# EAGLE design Adafruit I2S Audio UDA1334 Bonnet (EAGLE 9.2.0)
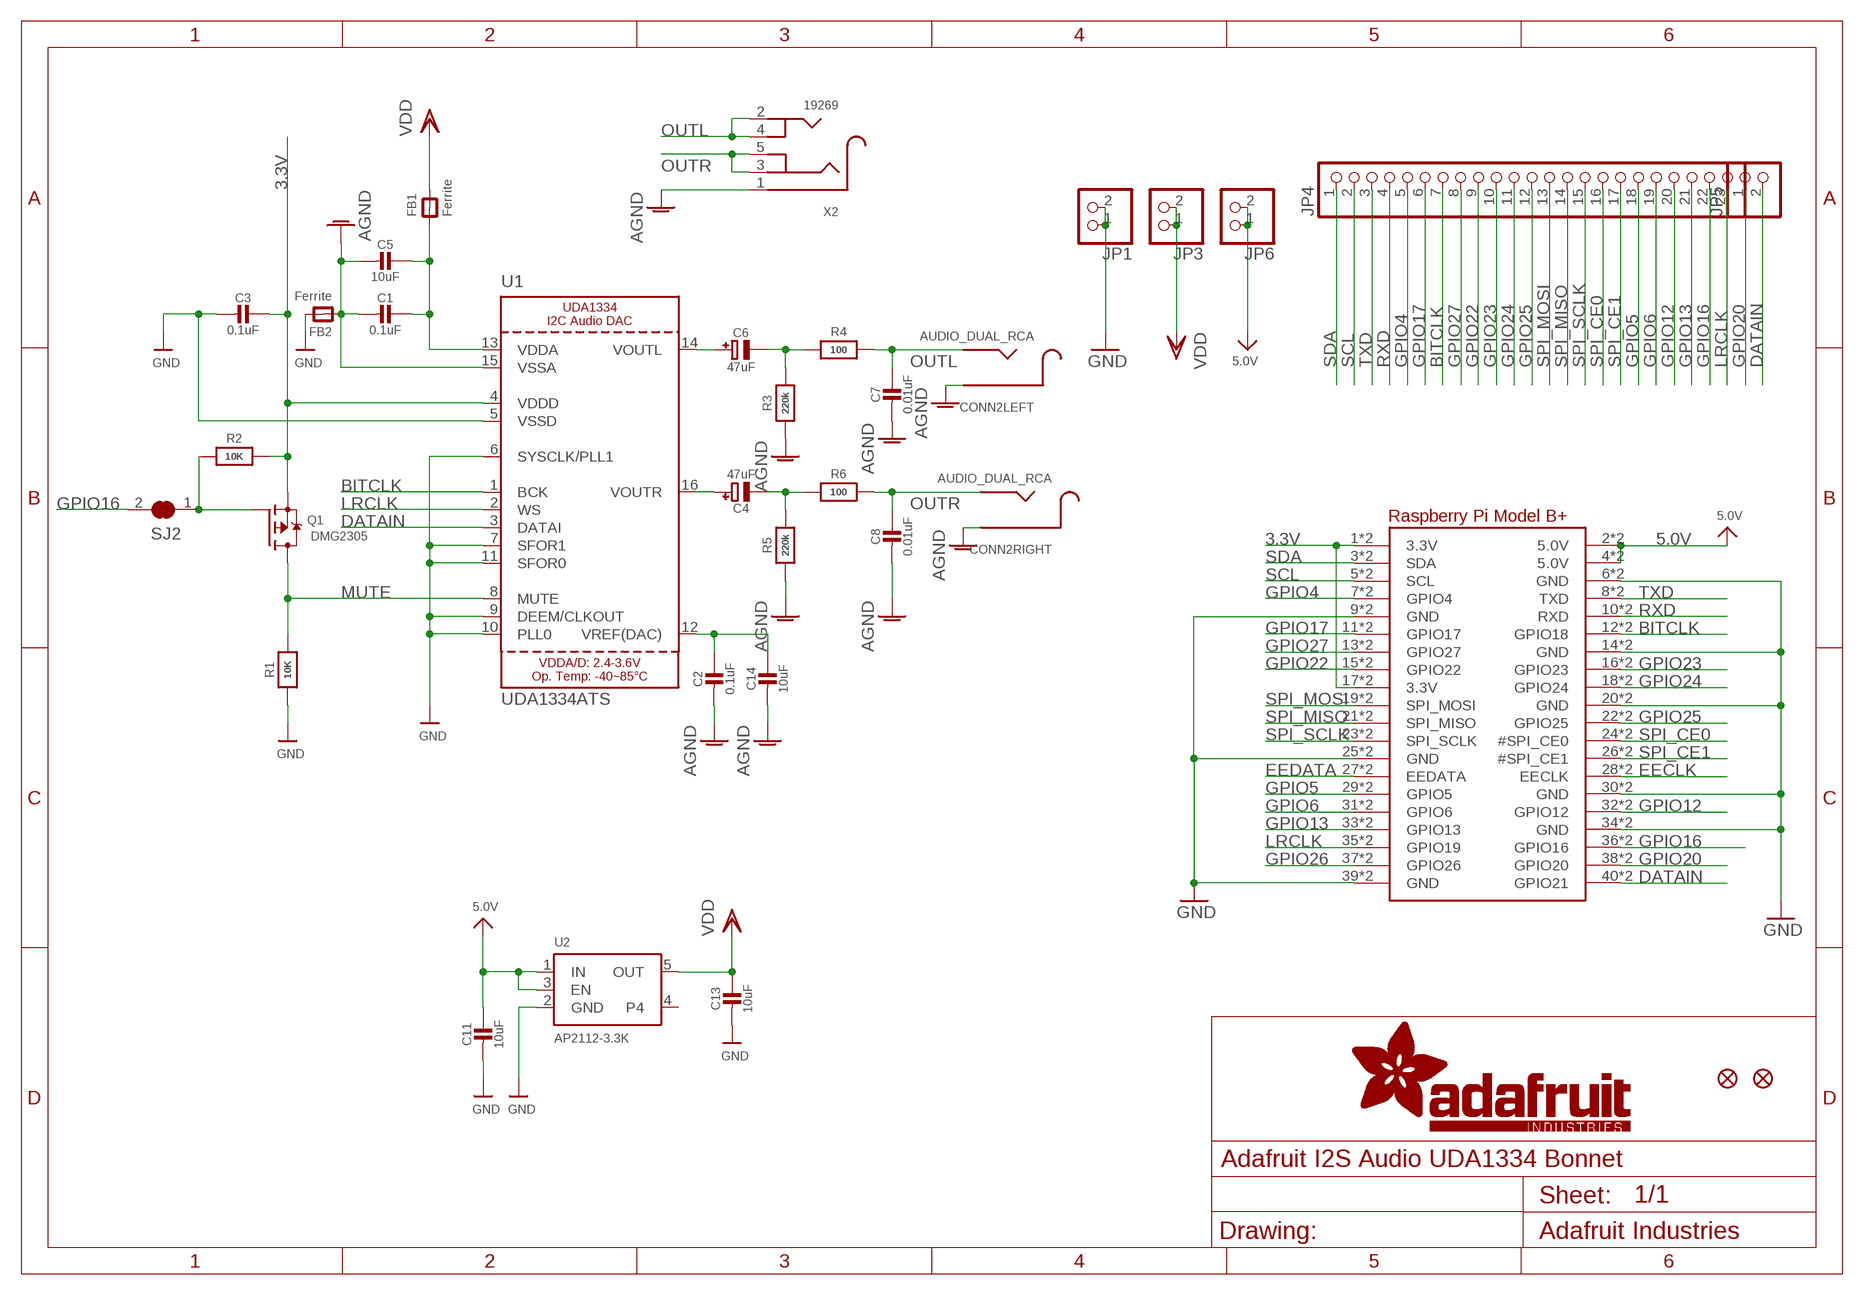
[diagram p0: schematic, sheet 1]

## Parts
C1  0.1uF  CAP_CERAMIC0603_NO  [0603-NO]
C2  0.1uF  CAP_CERAMIC0603_NO  [0603-NO]
C3  0.1uF  CAP_CERAMIC0603_NO  [0603-NO]
C4  47uF  CAP_ELECTROLYTICPANASONIC_C  [PANASONIC_C]
C5  10uF  CAP_CERAMIC0805-NOOUTLINE  [0805-NO]
C6  47uF  CAP_ELECTROLYTICPANASONIC_C  [PANASONIC_C]
C7  0.01uF  CAP_CERAMIC0603_NO  [0603-NO]
C8  0.01uF  CAP_CERAMIC0603_NO  [0603-NO]
C11  10uF  CAP_CERAMIC0805-NOOUTLINE  [0805-NO]
C13  10uF  CAP_CERAMIC0805-NOOUTLINE  [0805-NO]
C14  10uF  CAP_CERAMIC0805-NOOUTLINE  [0805-NO]
CONN2  AUDIO_DUAL_RCA  [RCA_DUAL_JACK]
FB1  Ferrite  FERRITE0805  [0805]
FB2  Ferrite  FERRITE0805  [0805]
FID1  FIDUCIAL_1MM  [FIDUCIAL_1MM]
FID2  FIDUCIAL_1MM  [FIDUCIAL_1MM]
JP1  HEADER-1X2ROUND  [1X02_ROUND]
JP3  HEADER-1X2ROUND  [1X02_ROUND]
JP4  HEADER-1X23  [1X23_ROUND_70MIL]
JP5  HEADER-1X2ROUND  [1X02_ROUND]
JP6  HEADER-1X2ROUND  [1X02_ROUND]
Q1  DMG2305  MOSFET-PWIDE  [SOT23-WIDE]
R1  10K  RESISTOR_0603_NOOUT  [0603-NO]
R2  10K  RESISTOR_0603_NOOUT  [0603-NO]
R3  220k  RESISTOR_0603_NOOUT  [0603-NO]
R4  100  RESISTOR_0603_NOOUT  [0603-NO]
R5  220k  RESISTOR_0603_NOOUT  [0603-NO]
R6  100  RESISTOR_0603_NOOUT  [0603-NO]
RPI1  RASPBERRYPI_BPLUS_BONNET_THMSMT  [PI_BONNET_THMSMT]
SJ2  SOLDERJUMPER_CLOSED  [SOLDERJUMPER_CLOSEDWIRE]
U1  UDA1334ATS  AUDIO_I2S_UDA1334""  [SSOP16_4.4MM]
U2  AP2112-3.3K  VREG_SOT23-5  [SOT23-5]
X2  19269  AUDIO_3.5MMJACK  [4UCONN_19269]

## Nets
3.3V: C3.1 Q1.2(S) R2.2 RPI1.1(3.3V) RPI1.17(3.3V) RPI1.S1(3.3V) RPI1.S17(3.3V) U1.4(VDDD)
5.0V: C11.1 JP6.1 JP6.2 RPI1.2(5.0V) RPI1.4(5.0V) RPI1.S2(5.0V) RPI1.S4(5.0V) U2.1(IN) U2.3(EN)
AGND: C1.2 C2.2 C5.2 C7.2 C8.2 C14.2 CONN2.L_G'(LEFT:SLEEVE) CONN2.L_G(LEFT:SLEEVE) CONN2.R_G'(RIGHT:SLEEVE) CONN2.R_G(RIGHT:SLEEVE) FB2.1 R3.1 R5.1 U1.15(VSSA) X2.1
BITCLK: JP4.7 RPI1.12(GPIO18) RPI1.S12(GPIO18) U1.1(BCK)
DATAIN: JP5.2 RPI1.40(GPIO21) RPI1.S40(GPIO21) U1.3(DATAI)
EECLK: RPI1.28(EECLK) RPI1.S28(EECLK)
EEDATA: RPI1.27(EEDATA) RPI1.S27(EEDATA)
GND: C3.2 C11.2 C13.2 FB2.2 JP1.1 JP1.2 R1.1 RPI1.6(GND) RPI1.9(GND) RPI1.14(GND) RPI1.20(GND) RPI1.25(GND) RPI1.30(GND) RPI1.34(GND) RPI1.39(GND) RPI1.S6(GND) RPI1.S9(GND) RPI1.S14(GND) RPI1.S20(GND) RPI1.S25(GND) RPI1.S30(GND) RPI1.S34(GND) RPI1.S39(GND) U1.5(VSSD) U1.6(SYSCLK/PLL1) U1.7(SFOR1) U1.9(DEEM/CLKOUT) U1.10(PLL0) U1.11(SFOR0) U2.2(GND)
GPIO4: JP4.5 RPI1.7(GPIO4) RPI1.S7(GPIO4)
GPIO5: JP4.18 RPI1.29(GPIO5) RPI1.S29(GPIO5)
GPIO6: JP4.19 RPI1.31(GPIO6) RPI1.S31(GPIO6)
GPIO12: JP4.20 RPI1.32(GPIO12) RPI1.S32(GPIO12)
GPIO13: JP4.21 RPI1.33(GPIO13) RPI1.S33(GPIO13)
GPIO16: JP4.22 RPI1.36(GPIO16) RPI1.S36(GPIO16) SJ2.2
GPIO17: JP4.6 RPI1.11(GPIO17) RPI1.S11(GPIO17)
GPIO20: JP5.1 RPI1.38(GPIO20) RPI1.S38(GPIO20)
GPIO22: JP4.9 RPI1.15(GPIO22) RPI1.S15(GPIO22)
GPIO23: JP4.10 RPI1.16(GPIO23) RPI1.S16(GPIO23)
GPIO24: JP4.11 RPI1.18(GPIO24) RPI1.S18(GPIO24)
GPIO25: JP4.12 RPI1.22(GPIO25) RPI1.S22(GPIO25)
GPIO26: RPI1.37(GPIO26) RPI1.S37(GPIO26)
GPIO27: JP4.8 RPI1.13(GPIO27) RPI1.S13(GPIO27)
LRCLK: JP4.23 RPI1.35(GPIO19) RPI1.S35(GPIO19) U1.2(WS)
MUTE: Q1.3(D) R1.2 U1.8(MUTE)
N$1: C2.1 C14.1 U1.12(VREF(DAC))
N$2: C1.1 C5.1 FB1.1 U1.13(VDDA)
N$3: C4.+ U1.16(VOUTR)
N$4: Q1.1(G) R2.1 SJ2.1
N$5: C6.+ U1.14(VOUTL)
N$7: C6.- R3.2 R4.1
N$8: C4.- R5.2 R6.1
OUTL: C7.1 CONN2.L_SIG'(LEFT:TIP) CONN2.L_SIG(LEFT:TIP) R4.2 X2.2 X2.4
OUTR: C8.1 CONN2.R_SIG'(RIGHT:TIP) CONN2.R_SIG(RIGHT:TIP) R6.2 X2.3 X2.5
RXD: JP4.4 RPI1.10(RXD) RPI1.S10(RXD)
SCL: JP4.2 RPI1.5(SCL) RPI1.S5(SCL)
SDA: JP4.1 RPI1.3(SDA) RPI1.S3(SDA)
SPI_CE0: JP4.16 RPI1.24(#SPI_CE0) RPI1.S24(#SPI_CE0)
SPI_CE1: JP4.17 RPI1.26(#SPI_CE1) RPI1.S26(#SPI_CE1)
SPI_MISO: JP4.14 RPI1.21(SPI_MISO) RPI1.S21(SPI_MISO)
SPI_MOSI: JP4.13 RPI1.19(SPI_MOSI) RPI1.S19(SPI_MOSI)
SPI_SCLK: JP4.15 RPI1.23(SPI_SCLK) RPI1.S23(SPI_SCLK)
TXD: JP4.3 RPI1.8(TXD) RPI1.S8(TXD)
VDD: C13.1 FB1.2 JP3.1 JP3.2 U2.5(OUT)
Unconnected: U2.4

## Library data of the parts
C1-C3 C5 C7 C8 C11 C13 C14 = microbuilder:CAP_CERAMIC: Ceramic Capacitors For new designs, use the packages preceded by an '_' character since they are more reliable: The following footprints should be used on most boards: _0402 - Standard footprint for regular board layouts _0603 - Standard footprint for regular board layouts _0805 - Standard footprint for regular board layouts _1206 - Standard footprint for regular board layouts For extremely tight-pitch boards where space is at a premium, the following 'micro-pitch' footprints can be used (smaller pads, no silkscreen outline, etc.): _0402MP - Micro-pitch footprint for very dense/compact boards _0603MP - Micro-pitch footprint for very dense/compact boards _0805MP - Micro-pitch footprint for very dense/compact boards _1206MP - Micro-pitch footprint for very dense/compact boards
C4 C6 = microbuilder:CAP_ELECTROLYTIC: Electrolytic Capacitors SMT PANASONIC_C - Size C Panasonic Electrolytic Aluminum Capacitor 47µF 16V 20% Electrolytic Capacitor [Digikey: PCE3890TR-ND] PANASONIC_D - Size D Panasonic Electrolytic Aluminum Capacitor 100µF 25V 20% Electrolytic Capacitor [Digikey: PCE3898TR-ND] PTH 3.5 mm grid, 8 mm diameter ... 3.5 mm grid, 10 mm diameter ...
CONN2 = microbuilder:AUDIO_DUAL_RCA
FB1 FB2 = microbuilder:FERRITE: Ferrite Bead 0603 MMZ1608B121C - 120 Ohm @ 100MHz, 600mA, 0.15 Ohm DC Resistance - Digikey: 445-2164-1-ND BK1608HW121-T - 120 Ohm, 600mA Ferrite Chip - Digikey: 587-1876-2-ND 0805 HZ0805B272R-10 - 2.7K Ohm @ 100MHz, 200mA, 0.8 Ohm DC Resistance - Digikey: 240-2504-1-ND (see also Murata BLM21BD272SN1L) MMZ2012Y152B - 1.5K Ohm @ 100MHz, 500mA, 0.4 Ohm DC Resistance - Digikey: 445-1560-1-ND - Mainly for high frequency (80-400MHz) MMZ2012R102A - 1K Ohm @ 100MHz, 500mA, 0.3 Ohm DC Resistance - Digikey: 445-1555-2-ND - More general purpose (10-200MHz)
FID1 FID2 = microbuilder:FIDUCIAL: Fiducial Alignment Points Various fiducial points for machine vision alignment.; BOM: EXCLUDE
JP1 JP3 JP5 JP6 = microbuilder:HEADER-1X2: PIN HEADER
JP4 = microbuilder:HEADER-1X23
Q1 = microbuilder:MOSFET-P: P-Channel Mosfet LEGEND VDS: Voltage Drain-Source ID: Drain Current RDS(ON): Drain-Source On-State Resistance VGS(TH): Gate-Source Threshold Voltage CISS: Drain-Source Input Capacitance SOT-23 Name VDS ID RDS(ON) VGS(TH) CISS Order Number IRLML5103 30V 760mA 600 mOhm -- 75pF @ 25V Digikey: IRLML5103PBFCT-ND IRLML6401 12V 4.3A 50 mOhm 950mV @ 250µA 830pF @ 10V Digikey: IRLML6401PBFTR-ND NTR0202PL 20V 400mA 800 mOhm 2.3V @ 250uA 70pF @ 5V Digikey: NTR0202PLT1GOSTR-ND NTR4101PT1G 20V 1.8A 85 mOhm 1.2V @ 250uA 675pF @ 10V Digikey: NTR4101PT1GOSCT-ND DMP2004K 20V 600mA 900 mOhm 1V @ 250uA 175pF @ 16V Digikey: DMP2004KDICT-ND PMV65XP 20V 3.9A 76 mOhm 950mV @ 1mA 725pF @ 20V Digikey: 568-2358-2-ND TO-252 Name VDS ID RDS(ON) VGS(TH) CISS Order Number AOD417 30V 25A 34 mOhm 3V @ 250µA 920pF @ 15V Digikey: 785-1106-2-ND PowerPak Name VDS ID RDS(ON) VGS(TH) CISS Order Number AON7401 30V 12A 14 mOhm 3V @ 250µA 2600pF @ 15V Digikey: 785-1302-1-ND
R1-R6 = microbuilder:RESISTOR: Resistors For new designs, use the packages preceded by an '_' character since they are more reliable: The following footprints should be used on most boards: _0402 - Standard footprint for regular board layouts _0603 - Standard footprint for regular board layouts _0805 - Standard footprint for regular board layouts _1206 - Standard footprint for regular board layouts For extremely tight-pitch boards where space is at a premium, the following 'micro-pitch' footprints can be used (smaller pads, no silkscreen outline, etc.): _0402MP - Micro-pitch footprint for very dense/compact boards _0603MP - Micro-pitch footprint for very dense/compact boards _0805MP - Micro-pitch footprint for very dense/compact boards _1206MP - Micro-pitch footprint for very dense/compact boards
RPI1 = microbuilder:RASPBERRYPI_BPLUS
SJ2 = microbuilder:SOLDERJUMPER_CLOSED: Solder Jumper - Closed These solder jumpers are closed by default CLOSEDWIRE - 10 mil trace between pads that can be cut and resoldered later CLOSEDPERM - 63 mil trace between pads for a permanent connection (used to 'bridge' two signals, a shameless hack for Eagle). Can double as a test point as well (no cream layer)
U1 = microbuilder:AUDIO_I2S_UDA1334: UDA1334 I2C Audio DAC Power Supply: 2.4-3.6V Sample frequencies from 16-100kHz
U2 = microbuilder:VREG_SOT23-5: SOT23-5 Fixed Voltage Regulators Part Current Out V Out V In V Dropout θJA (°C/W) TJ (°C) Digikey Part No. ADP121 150mA 3.3V 3.4-5.5V 0.09V @ 150mA -- -- ADP121-AUJZ33R7CT-ND ADP121 150mA 3.0V 3.1-5.5V 0.09V @ 150mA -- -- ADP121-AUJZ30R7CT-ND ADP122 300mA 3.3V 3.4-5.5V 0.085V @ 300mA -- -- ADP122AUJZ-3.3-R7CT-ND ADP1712 300mA 3.3V 3.5-5.5V 0.17V @ 300mA -- -- ADP1712AUJZ-3.3-R7TR-ND AP7311 (Low Cost) 150mA 3.3V 3.5-6V 0.15V @ 150mA -- -- AP7311-33WG-7DICT-ND LD39015M18R 150mA 1.8V 1.9V-5.5V 0.08V @ 100mA -- -- 497-6977-1-ND LP2985A-33DBVR 150mA 3.3V 3.3-16V 0.28V @ 150mA 206 150 296-18479-1-ND MCP1824T-3302E/OT 300mA 3.3V 3.5V-6V 0.2V @ 300mA -- -- MCP1824T-3302E/OTCT-ND MIC5205-2.5YM5 TR 150mA 2.5V 2.7-16V 0.165V @ 150mA -- -- 576-1257-2-ND MIC5205-3.0YM5 TR 150mA 3.0V 3.2V-16V 0.165V @ 150mA -- -- 576-1258-2-ND MIC5205-3.3YM5 TR 150mA 3.3V 3.5V-16V 0.165V @ 150mA -- -- 576-1259-2-ND TPS780330220 150mA 3.3V+2.2V 3.6-5.5V 250mV Max -- -- 296-23332-1-ND TDA3663/N1,135 100mA 3.3V 3.5-45V 0.18V @ 50mA -- -- 568-5343-1-ND Max operating temp can be calculated using θJA, TJ (max junction temperature), and power in watts. Set the "Maximum Ambient Temperature" until it reaches TJ ("Max Junction Temperature"), which is the absolute limit for safe use of the regulator: Heat Sink Temperature Calculator <http://www.daycounter.com/Calculators/Heat-Sink-Temperature-Calculator.phtml> For example, With 12V source into a 3.3V LP2985 and a 30mA load, we are dissipating (12V-3.3V) * 0.03A = 0.261W. With a θJA of 206 °C/W, a TJ of 150°C, and 261mW we can safely use the chip without a heat sink up to 75°C (=147.1°C Junction Temperature).
X2 = microbuilder:AUDIO_3.5MMJACK: 3.5MM Audio Jack These are normally connected as follows, from left-to right on the schematic symbol above: Tip: Left Audio Inner Ring: Right Audio Shell: Common/GND

## Board
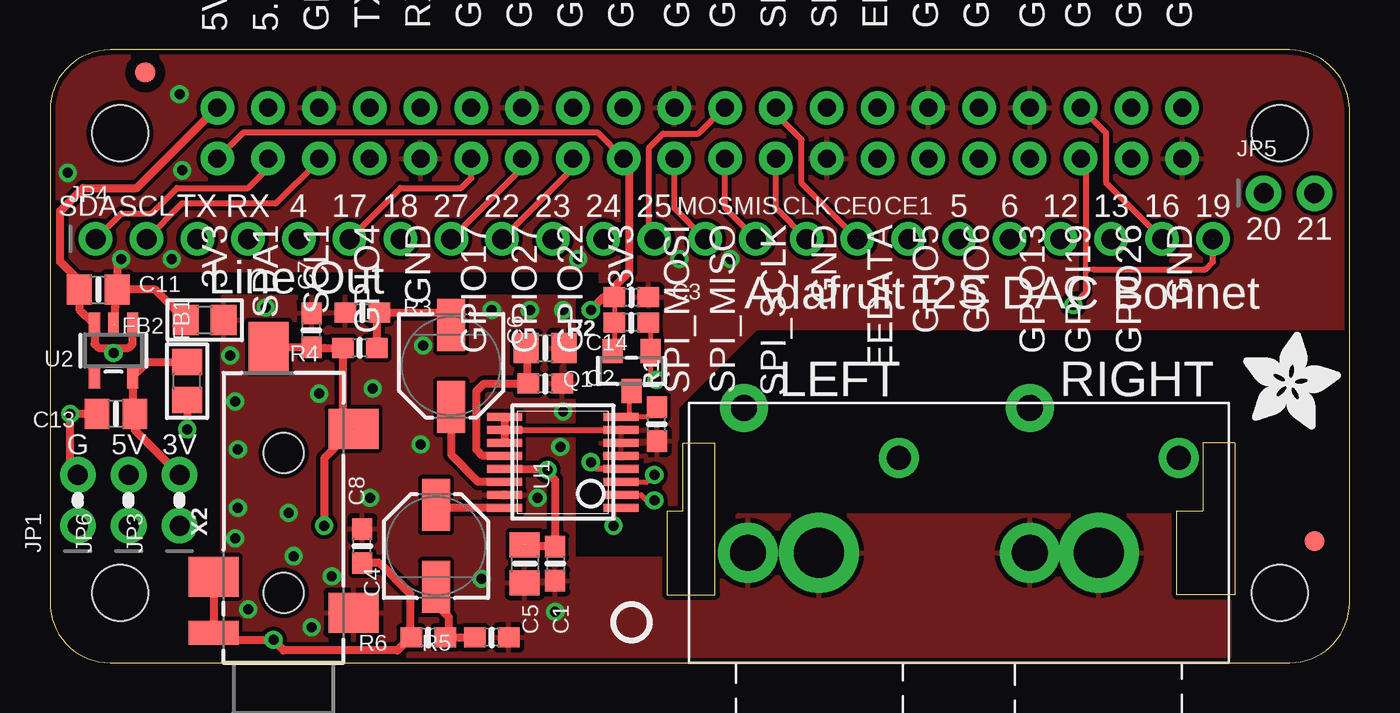
[diagram p1: board, top side]
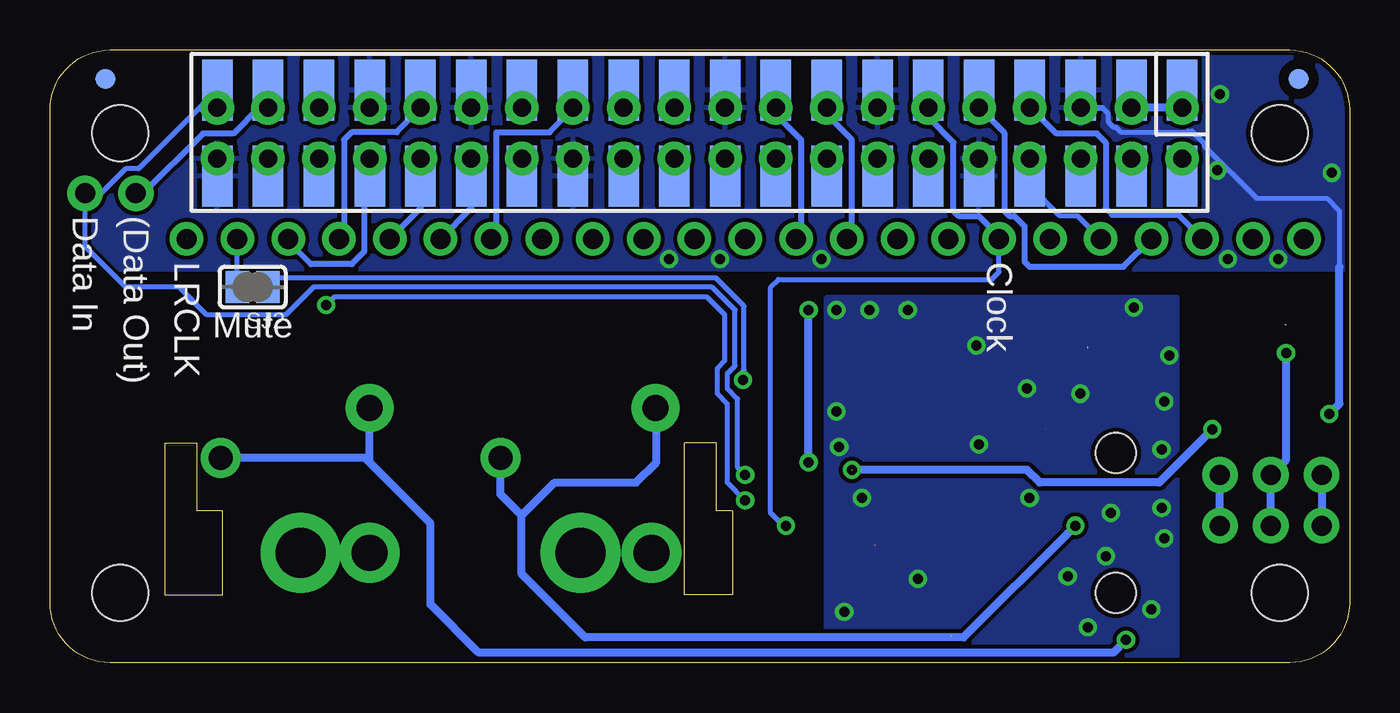
[diagram p2: board, bottom side, seen from below]

Size 65 x 30.66 mm. Coordinates in mm from the lower left corner, seen from the top.
Copper layers (1*16): Top 0.035mm / dielectric 1.5mm / Bottom 0.035mm
Design rules "adafruit *": minimum track width 8mil, minimum drill 15.5mil, track to track 8mil, track to pad 8mil, pad to pad 8mil, via to via 8mil, smd to smd 8mil, copper to edge 10mil, drill to drill 8mil, minimum pad ring 10mil, minimum via ring 8mil, stop-mask expansion 2mil, vias tented up to drill 20mil, thermal gap 10mil

### Footprints (pad centres in the part's own frame; a part is rotated, then mirrored left to right if it is on the bottom)
0603-NO = smd 1.075 x 1: 1 -0.85,0; 2 0.85,0
PANASONIC_C = smd 2.6 x 1.4: + 2.05,0; - -2.05,0
0805-NO = smd 1.24 x 1.5: 1 -0.95,0; 2 0.95,0
RCA_DUAL_JACK = drill 1.8 pad 3: L_G -10.55,5.5; R_G 3.55,5.5 | drill 2.5 pad 4: L_G' -7,5.5; R_G' 7,5.5 | drill 1.3 pad 2.4: L_SIG -10.75,12.75; R_SIG 3.55,12.75 | drill 1.2 pad 2: L_SIG' -3,10.25; R_SIG' 11,10.25
0805 = smd 1.3 x 1.5: 1 -0.95,0; 2 0.95,0
FIDUCIAL_1MM = smd 1 x 1: 1 0,0
1X02_ROUND = drill 1 pad 1.778: 1 -1.27,0; 2 1.27,0
1X23_ROUND_70MIL = drill 1 pad 1.676: 1 -27.94,0; 2 -25.4,0; 3 -22.86,0; 4 -20.32,0; 5 -17.78,0; 6 -15.24,0; 7 -12.7,0; 8 -10.16,0; 9 -7.62,0; 10 -5.08,0; 11 -2.54,0; 12 0,0; 13 2.54,0; 14 5.08,0; 15 7.62,0; 16 10.16,0; 17 12.7,0; 18 15.24,0; 19 17.78,0; 20 20.32,0; 21 22.86,0; 22 25.4,0; 23 27.94,0
SOT23-WIDE = smd 1 x 1.2: 1 -0.95,-1; 2 0.95,-1; 3 0,1
PI_BONNET_THMSMT = drill 0.9 pad 1.676: 1 8.37,25.23; 2 8.37,27.77; 3 10.91,25.23; 4 10.91,27.77; 5 13.45,25.23; 6 13.45,27.77; 7 15.99,25.23; 8 15.99,27.77; 9 18.53,25.23; 10 18.53,27.77; 11 21.07,25.23; 12 21.07,27.77; 13 23.61,25.23; 14 23.61,27.77; 15 26.15,25.23; 16 26.15,27.77; 17 28.69,25.23; 18 28.69,27.77; 19 31.23,25.23; 20 31.23,27.77; 21 33.77,25.23; 22 33.77,27.77; 23 36.31,25.23; 24 36.31,27.77; 25 38.85,25.23; 26 38.85,27.77; 27 41.39,25.23; 28 41.39,27.77; 29 43.93,25.23; 30 43.93,27.77; 31 46.47,25.23; 32 46.47,27.77; 33 49.01,25.23; 34 49.01,27.77; 35 51.55,25.23; 36 51.55,27.77; 37 54.09,25.23; 38 54.09,27.77; 39 56.63,25.23; 40 56.63,27.77 | smd 1 x 1 bottom: 41 2.54,29.21; 42 62.23,29.21 | smd 1.524 x 3.048 bottom: S1 8.37,24.339; S2 8.37,28.657; S3 10.91,24.339; S4 10.91,28.657; S5 13.45,24.339; S6 13.45,28.657; S7 15.99,24.339; S8 15.99,28.657; S9 18.53,24.339; S10 18.53,28.657; S11 21.07,24.339; S12 21.07,28.657; S13 23.61,24.339; S14 23.61,28.657; S15 26.15,24.339; S16 26.15,28.657; S17 28.69,24.339; S18 28.69,28.657; S19 31.23,24.339; S20 31.23,28.657; S21 33.77,24.339; S22 33.77,28.657; S23 36.31,24.339; S24 36.31,28.657; S25 38.85,24.339; S26 38.85,28.657; S27 41.39,24.339; S28 41.39,28.657; S29 43.93,24.339; S30 43.93,28.657; S31 46.47,24.339; S32 46.47,28.657; S33 49.01,24.339; S34 49.01,28.657; S35 51.55,24.339; S36 51.55,28.657; S37 54.09,24.339; S38 54.09,28.657; S39 56.63,24.339; S40 56.63,28.657 | hole 2.8: 3.5,26.5; 61.5,26.5; 61.5,3.5; 3.5,3.5
SOLDERJUMPER_CLOSEDWIRE = smd 1.168 x 1.6: 1 -0.762,0; 2 0.762,0 | smd 0.635 x 0.203: WIRE 0,0
SSOP16_4.4MM = smd 0.4 x 1.75: 1 -2.275,-2.92; 2 -1.625,-2.92; 3 -0.975,-2.92; 4 -0.325,-2.92; 5 0.325,-2.92; 6 0.975,-2.92; 7 1.625,-2.92; 8 2.275,-2.92; 9 2.275,2.92; 10 1.625,2.92; 11 0.975,2.92; 12 0.325,2.92; 13 -0.325,2.92; 14 -0.975,2.92; 15 -1.625,2.92; 16 -2.275,2.92
SOT23-5 = smd 0.55 x 1.2: 1 -0.95,-1.3; 2 0,-1.3; 3 0.95,-1.3; 4 0.95,1.3; 5 -0.95,1.3
4UCONN_19269 = smd 2 x 2.5: 1 2.5,-3.5; 2 11.7,-3.5; 3 4.3,3.5 | smd 2.5 x 2: 4 15.8,0.75 | smd 1.2 x 2.5: 5 1.5,3.5 | hole 2: 3.5,0; 10.5,0

### Placement (x,y rotation side)
C1  25.27,4.95 270 top
C2  24.77,13.97 0 top
C3  29.08,18.29 0 top
C4  19.3,5.84 90 top
C5  23.75,4.95 270 top
C6  20.07,14.86 270 top
C7  13.08,16.64 90 top
C8  15.62,5.84 90 top
C11  2.41,18.67 0 top
C13  3.3,12.45 180 top
C14  24.77,15.75 0 top
CONN2  45.47,0 0 top
FB1  6.86,14.1 90 top
FB2  7.75,17.14 180 top
FID1  4.76,29.53 0 top
FID2  63.25,6.1 0 top
JP1  1.4,8.13 90 top
JP3  6.48,8.13 90 top
JP4  30.23,21.21 0 top
JP5  61.98,23.5 0 top
JP6  3.94,8.13 90 top
Q1  29.08,14.61 180 top
R1  30.35,11.94 90 top
R2  29.08,17.02 180 top
R3  15.62,17.53 0 top
R4  15.49,15.75 180 top
R5  22.1,1.27 180 top
R6  18.92,1.27 180 top
RPI1  0,0 0 top
SJ2  54.86,18.8 180 bottom
U1  25.65,10.03 90 top
U2  3.17,15.62 180 top
U$5  [ADAFRUIT_5MM]  59.69,11.68 0 top
U$11  [PCBFEAT-REV-040]  29.08,2.03 0 top
X2  11.68,0 90 top

### Tracks (layer width: path | path; a pad name or v marks a point on that pad's centre or on a via)
3.3V  (via drill 0.5)
  Top 0.254: 28.11,15.63 28.23,15.76 R2.2 28.23,18.16 | 28,18.52 28,18.61
  Top 0.305: RPI1.1 9.68,26.54 27.38,26.54 RPI1.17 | U1.4 27.38,9.71 v27.05,10.03 | 28.11,15.63 Q1.2
  Top 0.406: RPI1.17 28.96,24.96 28.96,19.56 28.23,18.84 C3.1 | 27.09,17.69 v27.05,17.65 27.69,18.29 C3.1 | C3.1 28.23,18.16 | C3.1 28,18.52
  Bottom 0.406: RPI1.1 | RPI1.1 RPI1.S1 | RPI1.S17 | RPI1.S17 RPI1.17 | v27.05,10.03 v27.05,17.65
5.0V  (via drill 0.5)
  Top 0.406: 3.17,15.75 2.41,15.75 2.23,15.94 U2.3 1.46,17.68 C11.1 1.46,19.11 0.51,20.07 0.51,22.61 1.65,23.75 4.35,23.75 RPI1.2 | 3.17,15.75 3.94,15.75 4.12,15.94 U2.1 | v3.17,15.49 3.17,15.75
  Bottom 0.305: RPI1.4 10.29,27.77
  Bottom 0.406: RPI1.2 10.29,27.77 | RPI1.2 | RPI1.2 RPI1.S2 | RPI1.S4 | RPI1.S4 RPI1.4 | JP6.1 JP6.2 3.17,10.16 v3.17,15.49
AGND  (via drill 0.5)
  other vias: 13.46,13.46 10.79,17.78 24.38,8.26 22.1,17.65 16.13,13.72 18.67,15.88 21.59,4.19 18.54,10.92 13.08,1.78 11.94,7.49 14.1,4.32 9.02,15.37 9.27,13.08 9.4,10.67 9.4,7.75 9.27,6.22 9.91,2.67 12.19,5.33 16,8.26 25.27,2.54 25.65,17.65 24,17.65 25.53,10.79 25.65,12.57
  pour Top: 8.64,18.29 26.16,18.29 26.16,5.21 32.26,5.21 34.42,7.37 58.93,7.37 58.93,0 8.64,0
  pour Bottom: 8.64,18.29 8.64,0 26.16,0 26.16,18.29
BITCLK  (via drill 0.5)
  Top 0.254: U1.1 28.2,7.76 28.2,6.86 v28.19,6.86
  Bottom 0.254: JP4.7 17.53,19.56 17.91,19.18 28.57,19.18 28.96,18.8 28.96,7.49 28.32,6.86 v28.19,6.86
  Bottom 0.305: JP4.7 18.03,21.72 18.03,21.84 18.54,22.35 19.56,22.35 19.81,22.61 19.81,26.04 21.07,27.29 RPI1.12
  Bottom 0.406: RPI1.S12 | RPI1.S12 RPI1.12
DATAIN  (via drill 0.5)  (1 unrouted)
  Top 0.254: 28.7,9.06 U1.3 28.7,9.06 | 28.7,9.06 29.89,9.06 v30.23,9.4
  Bottom 0.254: 56.68,27.69 56.63,27.73 | v30.23,9.4 30.61,9.78 30.61,13.21 31.11,13.72 31.11,14.48 30.73,14.86 30.73,17.65 31.88,18.8 51.82,18.8 53.21,17.4 57.15,17.4 58.55,18.8 61.21,18.8 63.25,20.83 JP5.2 62.43,23.5 61.21,24.71 60.57,24.71 RPI1.S40 | RPI1.S40
  Bottom 0.305: 57.4,27.69 56.68,27.69 | RPI1.40 56.63,27.73
  Bottom 0.406: RPI1.S40 RPI1.40
EECLK
  Bottom 0.406: RPI1.S28 | RPI1.S28 RPI1.28
EEDATA
  Bottom 0.406: RPI1.S27 | RPI1.S27 RPI1.27
GND  (via drill 0.5)  (1 unrouted)
  Top 0.254: v3.56,20.19 3.36,20 3.36,19.88 | C11.2 3.27,18.67
  Top 0.305: U1.10 U1.7
  Top 0.406: U1.9 U1.10 U1.11 | 3.25,16.92 3.27,17.85 3.27,18.67 | 3.36,19.88 C11.2 5.27,18.67 FB2.2 | C13.2 v1.02,12.45 1.02,9.78 JP1.2
  Bottom 0.254: 12.36,27.77 12.08,27.49 12.08,27.07 11.81,26.8 11.69,26.8 11.43,26.54 8.13,26.54 8.07,26.6 7.88,26.6 7.28,26 7.28,25.88 4.64,23.24 1.14,23.24 0.51,22.61 0.51,19.81
  Bottom 0.305: RPI1.6 12.36,27.77
  Bottom 0.406: JP1.2 JP1.1 | v1.02,12.45 0.51,12.95 0.51,19.81
  other vias: 34.04,20.19 6.48,28.45 31.5,20.19 26.42,20.19 6.6,24.64 6.1,20.19 0.89,24.51
  pour Top: 0,30.73 0,19.68 27.56,19.68 27.56,5.84 31.37,5.84 31.37,12.83 35.31,16.76 65.02,16.76 65.02,30.73
  pour Bottom: 0,30.73 0,19.68 65.02,19.68 65.02,30.73
GPIO4  (1 unrouted)
  Bottom 0.254: JP4.5 13.59,22.35 14.48,22.35 15.99,23.86 RPI1.7
  Bottom 0.406: RPI1.S7 | RPI1.S7 RPI1.7
GPIO5
  Bottom 0.305: RPI1.29 43.93,24.13 43.93,22.75 JP4.18
  Bottom 0.406: RPI1.S29 | RPI1.S29 43.93,24.13
GPIO6
  Bottom 0.305: RPI1.31 46.47,24.64 46.47,22.75 JP4.19
  Bottom 0.406: RPI1.S31 | RPI1.S31 46.47,24.64
GPIO12
  Bottom 0.305: JP4.20 50.29,21.46 50.29,26.16 49.91,26.54 47.66,26.54 46.47,27.73 RPI1.32
  Bottom 0.406: RPI1.S32 | RPI1.S32 RPI1.32
GPIO13
  Bottom 0.305: JP4.21 53.09,21.08 51.94,19.94 49.91,19.94 49.28,20.57 49.28,23.88 49.1,24.05 | RPI1.33 | RPI1.33 49.01,24.89
  Bottom 0.406: 49.1,24.05 49.02,24.05 49.02,24.89 49.01,24.89 RPI1.S33
GPIO16
  Top 0.254: JP4.22 | RPI1.36
  Top 0.305: JP4.22 52.83,24 52.83,26.49 RPI1.36
  Bottom 0.254: SJ2.2 JP4.22
  Bottom 0.406: RPI1.S36 | RPI1.S36 RPI1.36
GPIO17
  Top 0.305: JP4.6 17.53,23.75 20.57,23.75 21.07,24.25 RPI1.11
  Bottom 0.406: RPI1.S11 | RPI1.S11 RPI1.11
GPIO20
  Bottom 0.305: RPI1.38 54.53,27.77 55.82,26.48 57.34,26.48 60.33,23.5 JP5.1
  Bottom 0.406: RPI1.S38 | RPI1.S38 RPI1.38
GPIO22
  Top 0.305: JP4.9 26.15,24.75 RPI1.15
  Bottom 0.406: RPI1.S15 | RPI1.S15 RPI1.15
GPIO23
  Bottom 0.305: JP4.10 24.89,21.46 24.89,26.16 26.15,27.42 RPI1.16
  Bottom 0.406: RPI1.S16 | RPI1.S16 RPI1.16
GPIO24
  Bottom 0.305: RPI1.18 28.69,27.42 27.43,26.16 27.43,21.46 JP4.11
  Bottom 0.406: RPI1.S18 | RPI1.S18 RPI1.18
GPIO25
  Top 0.305: JP4.12 29.97,21.46 29.97,25.78 30.67,26.48 32.45,26.48 33.74,27.77 RPI1.22
  Bottom 0.406: RPI1.S22 | RPI1.S22 RPI1.22
GPIO26
  Bottom 0.406: RPI1.S37 | RPI1.S37 RPI1.37
GPIO27
  Top 0.305: JP4.8 23.61,24.75 RPI1.13
  Bottom 0.406: RPI1.S13 | RPI1.S13 RPI1.13
LRCLK  (via drill 0.5)  (1 unrouted)
  Top 0.254: U1.2 29.57,8.41 29.84,8.13 v30.23,8.13 | v51.18,17.91 51.82,18.54 51.82,19.56 | 51.82,19.56 51.82,20.32 | 52.2,19.68 51.94,19.68 51.82,19.56
  Top 0.305: RPI1.35 51.82,24.96 51.82,20.32 | JP4.23 58.17,20.07 57.78,19.68 52.2,19.68
  Bottom 0.254: v51.18,17.91 50.8,18.29 32.13,18.29 31.24,17.4 31.24,15.11 31.62,14.73 31.62,13.46 31.11,12.95 31.11,10.03 31.11,9.02 v30.23,8.13
  Bottom 0.406: RPI1.S35 | RPI1.S35 RPI1.35
MUTE
  Top 0.254: R1.2 29.87,12.31 28.96,12.31 | 28.96,12.31 U1.8 | Q1.3 28.96,13.48 28.96,12.31
N$1
  Top 0.254: C14.1 23.86,15.75 | C2.1 23.86,13.97
  Top 0.406: 23.86,15.75 23.86,13.97 21.72,13.97 21.34,13.59 21.34,10.67 21.65,10.36 U1.12
N$2  (via drill 0.5)  (2 unrouted)
  Top 0.254: 25.27,5.84 C1.1 | C1.1 | 24.86,9.68 24.84,9.71 24.71,9.71
  Top 0.406: U1.13 24.71,9.71 25.27,9.14 C1.1 | 25.27,5.84 23.76,5.84 C5.1 | FB1.1 v6.86,11.68 | 24.86,9.68 24.71,9.68
  Bottom 0.406: v6.86,11.68 9.53,9.02 15.49,9.02 16.13,9.65 v24.89,9.65
N$3
  Top 0.406: U1.16 19.44,7.76 C4.+
N$4  (via drill 0.5)
  Top 0.254: v30.33,14.15 30.03,14.45 Q1.1 30.03,16.92 R2.1
  Bottom 0.254: v30.33,14.15 30.33,14.62 30.28,14.67 30.28,17.84 31.69,19.25 53.65,19.25 SJ2.1
N$5
  Top 0.254: U1.14
  Top 0.406: C6.+ 20.07,10.41 21.42,9.06 U1.14
N$7
  Top 0.406: R4.1 16.34,17.4 R3.2 19.45,17.53 C6.-
N$8  (1 unrouted)
  Top 0.254: R6.1 19.87,1.27 19.94,1.34
  Top 0.406: C4.- 19.3,2.92 19.94,2.29 19.94,1.34 | 19.94,1.32 19.77,1.32 | R6.1 R5.2
OUTL  (via drill 0.5)  (3 unrouted)
  Top 0.254: C7.1 13.08,15.77
  Top 0.406: 13.08,15.77 C7.1 X2.4 | X2.2 13.72,10.23 v13.72,6.86 | 13.08,15.76 13.72,15.75 R4.2 14.64,11.96 14.93,11.95 X2.2
  Bottom 0.254: 14.1,6.48 v13.72,6.86
  Bottom 0.406: 14.1,6.48 v13.72,6.86 14.1,6.48 | 14.1,6.48 19.3,1.27 38.23,1.27 41.4,4.45 41.4,7.37 | 41.4,7.37 39.75,9.02 35.69,9.02 34.67,10.03 34.67,12.71 CONN2.L_SIG | 41.4,7.37 42.47,8.43 CONN2.L_SIG'
OUTR  (via drill 0.5)
  Top 0.254: R6.2 18.07,1.72 | 18.07,1.72 18.01,1.78 | R6.2 18.02,1.27 17.87,1.12 | 18.02,1.27 17.87,1.12 18.02,1.27 | R6.2 18.02,1.27 | 18.02,1.27 17.87,1.12 | 18.02,1.27 17.87,1.12 18.02,1.27 | 18.07,1.72 18,1.78 | 18.02,1.27 17.87,1.12
  Top 0.406: X2.3 X2.5 8.54,1.14 | 8.54,1.14 v11.18,1.14 | 18,3.49 16.48,5 | 16.48,5 C8.1 | 18.05,1.29 17.87,1.12 | 17.87,1.12 17.36,0.62 11.69,0.63 v11.17,1.14 | 18,3.49 18,1.78 18,3.49 | 18.02,1.78 18.02,1.27 18.02,1.78 | 18.02,1.78 18.02,1.27 | 18,3.49 18,1.78 | v11.18,1.14 11.68,0.64 17.36,0.63 17.87,1.12 | 17.87,1.12 17.37,0.62 | 17.87,1.12 17.37,0.62 | 17.87,1.12 17.37,0.62 | 17.99,3.48 16.48,5 | 18,3.49 16.48,5 | 17.87,1.12 17.36,0.61 | 17.87,1.12 17.36,0.61 | v11.17,1.14 11.68,0.62 17.36,0.61 | 17.37,0.62 11.68,0.63 v11.18,1.14 | 18,3.49 18,1.78 | 18,3.49 18.02,1.78 | 18,3.49 18.02,1.78 | 18,3.49 18.01,1.78 | 18.02,1.78 18.02,1.27 | 18,1.78 18.02,1.27 | 18.02,1.78 18.02,1.27 | 18,1.78 18.02,1.27 | 18.02,1.78 18.02,1.27 | 18.02,1.78 18.02,1.27 | 18.05,1.29 17.87,1.12 | 18.05,1.29 17.87,1.12 | 8.54,1.14 v11.17,1.14
  Bottom 0.406: v11.18,1.14 11.81,0.51 43.56,0.51 45.97,2.92 45.97,6.99 49.02,10.03 | 49.02,10.03 CONN2.R_SIG | 49.02,10.03 49.24,10.25 CONN2.R_SIG'
RXD
  Bottom 0.254: JP4.4
  Bottom 0.305: RPI1.10 17.27,26.51 17.27,22.61 17.02,22.35 16.76,22.35 16.26,21.84 16.26,20.07 16,19.81 11.3,19.81 JP4.4
  Bottom 0.406: RPI1.S10 | RPI1.S10 RPI1.10
SCL
  Top 0.305: JP4.2 6.6,22.99 11.3,22.99 13.45,25.13 RPI1.5
  Bottom 0.406: RPI1.S5 | RPI1.S5 RPI1.5
SDA
  Top 0.305: JP4.1 3.56,22.48 5.08,22.48 6.35,23.75 9.91,23.75 10.91,24.75 RPI1.3
  Bottom 0.406: RPI1.S3 | RPI1.S3 RPI1.3
SPI_CE0  (2 unrouted)
  Top 0.254: JP4.16 40.16,21.43
  Top 0.305: JP4.16 40.16,21.43 37.59,24 37.59,26.16 36.31,27.44 RPI1.24
  Bottom 0.406: RPI1.S24 | RPI1.S24 RPI1.24
SPI_CE1
  Bottom 0.305: JP4.17 42.67,21.46 42.67,26.54 40.01,26.54 38.85,27.7 RPI1.26
  Bottom 0.406: RPI1.S26 | RPI1.S26 RPI1.26
SPI_MISO
  Top 0.305: JP4.14 33.77,22.75 RPI1.21
  Bottom 0.406: RPI1.S21 | RPI1.S21 RPI1.21
SPI_MOSI
  Top 0.305: JP4.13 31.23,22.75 RPI1.19
  Bottom 0.406: RPI1.S19 | RPI1.S19 RPI1.19
SPI_SCLK
  Top 0.305: JP4.15 36.31,22.75 RPI1.23
  Bottom 0.406: RPI1.S23 | RPI1.S23 RPI1.23
TXD
  Bottom 0.305: JP4.3 8.57,22.42 11.87,22.42 12.19,22.73 12.19,26.04 12.64,26.48 14.67,26.48 15.96,27.77 RPI1.8
  Bottom 0.406: RPI1.S8 | RPI1.S8 RPI1.8
VDD
  Top 0.406: FB1.2 4.85,15.05 U2.5 4.12,12.57 C13.1 4.25,11.62 JP3.2
  Bottom 0.406: JP3.1 JP3.2

### Text on the board
tPlace: SDA | SCL | TX | RX | 4 | 17 | 18 | 27 | 22 | 23 | 24 | 25 | MOS | MIS | CLK | CE0 | CE1 | 5 | 6 | 12 | 13 | 16 | 19 | 20 | 21 | Line Out | Adafruit I2S DAC Bonnet | LEFT | RIGHT | G | 5V | 3V
bPlace: (Data Out) | Data In | Clock | LRCLK | Mute